# EAGLE design tl494 (EAGLE 9.4.2)
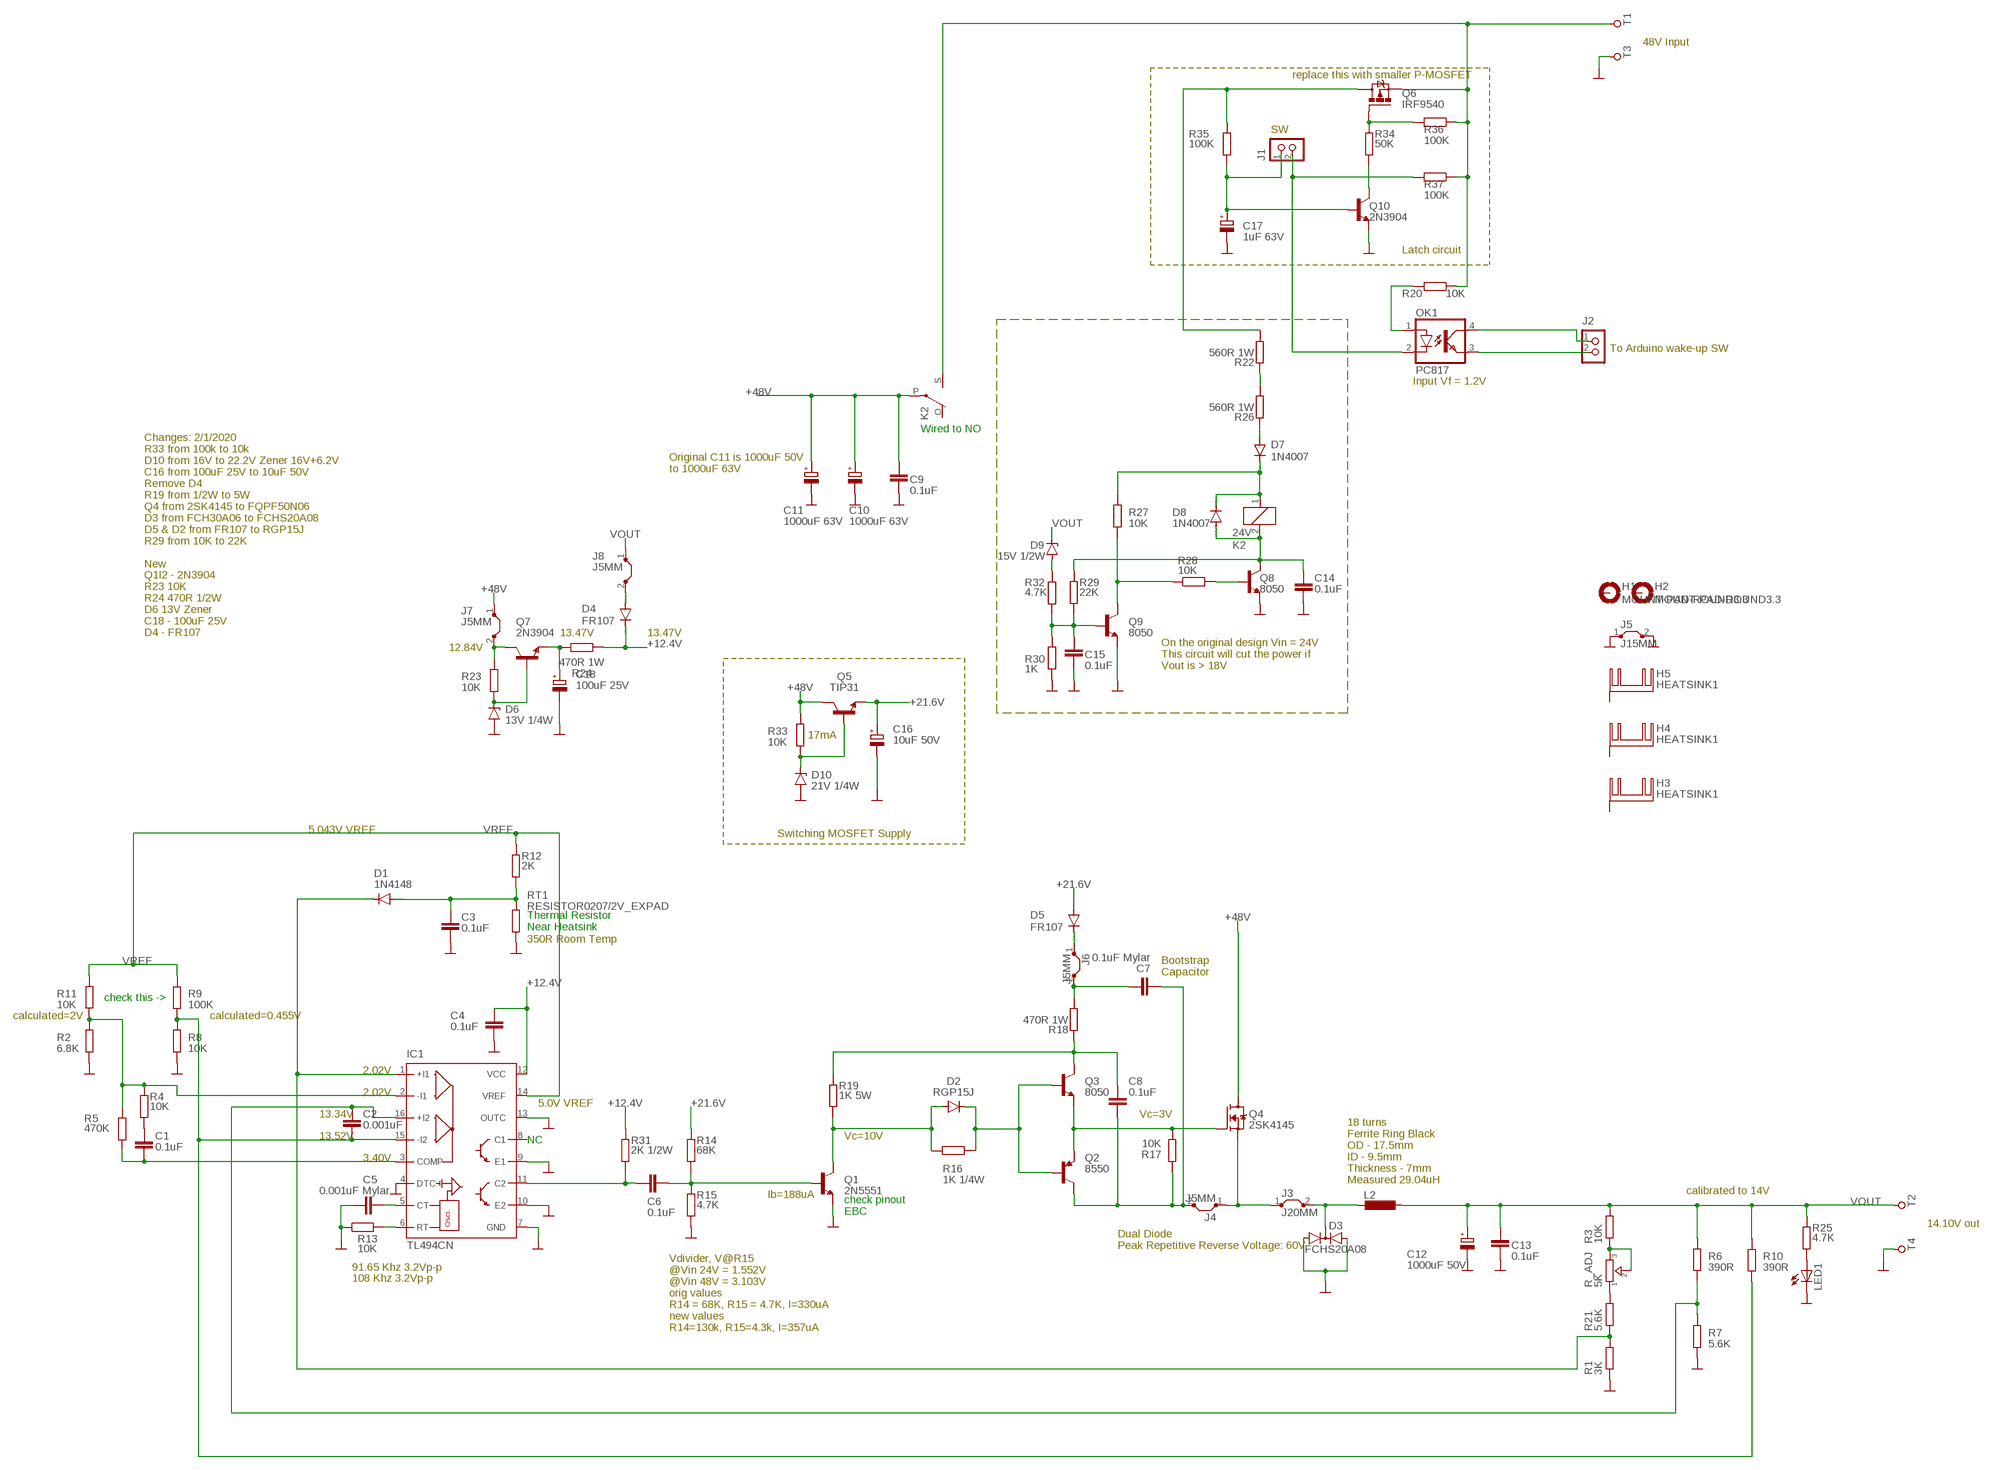
[diagram p0: schematic, sheet 1]

## Parts
C1  0.1uF  CAPACITORC050-024X044_EXPAD  [C050-024X044_EXPAD]
C2  0.001uF  CAPACITORC050-024X044_EXPAD  [C050-024X044_EXPAD]
C3  0.1uF  CAPACITORC050-024X044_EXPAD  [C050-024X044_EXPAD]
C4  0.1uF  CAPACITORC050-024X044_EXPAD  [C050-024X044_EXPAD]
C5  0.001uF Mylar  CAPACITORC050-024X044_EXPAD  [C050-024X044_EXPAD]
C6  0.1uF  CAPACITORC050-024X044_EXPAD  [C050-024X044_EXPAD]
C7  0.1uF Mylar  CAPACITORC050-050X075_EXPAD  [C050-050X075_EXPAD]
C8  0.1uF  CAPACITORC050-024X044_EXPAD  [C050-024X044_EXPAD]
C9  0.1uF  CAPACITORC050-024X044_EXPAD  [C050-024X044_EXPAD]
C10  1000uF 63V  CPOL-EUE7.5-18  [E7,5-18]
C11  1000uF 63V  CPOL-EUE7.5-18  [E7,5-18]
C12  1000uF 50V  CPOL-EUE5-13  [E5-13]
C13  0.1uF  CAPACITORC050-024X044_EXPAD  [C050-024X044_EXPAD]
C14  0.1uF  CAPACITORC050-024X044_EXPAD  [C050-024X044_EXPAD]
C15  0.1uF  CAPACITORC050-024X044_EXPAD  [C050-024X044_EXPAD]
C16  10uF 50V  CAPACITOR-POLE2,5-7_EXPAD  [E2,5-7_EXPAD]
C17  1uF 63V  CAPACITOR-POLE2,5_EXPAD  [E2-5_EXPAD]
C18  100uF 25V  CAPACITOR-POLE2,5-7_EXPAD  [E2,5-7_EXPAD]
D1  1N4148  1N4148DO35-10  [DO35-10]
D2  RGP15J  1N4933  [DO41-10]
D3  FCHS20A08  DIODE-2AC|CATO220V  [TO220ABS]
D4  FR107  1N4933  [DO41-10]
D5  FR107  1N4933  [DO41-10]
D6  13V 1/4W  BZV10  [DO34Z7]
D7  1N4007  1N4933  [DO41-10]
D8  1N4007  1N4933  [DO41-10]
D9  15V 1/2W  BZV10  [DO34Z7]
D10  21V 1/4W  BZV10  [DO34Z7]
H1  MOUNT-PAD-ROUND3.3  [3,3-PAD]
H2  MOUNT-PAD-ROUND3.3  [3,3-PAD]
H3  HEATSINK1  [TO-220_HEATSINK1]
H4  HEATSINK1  [TO-220_HEATSINK1]
H5  HEATSINK1  [TO-220_HEATSINK1]
IC1  TL494CN  [DIL16]
J1  CON_HEADER_1X02-PTH  [M1X2]
J2  CON_HEADER_1X02-PTH  [M1X2]
J3  J20MM  [20]
J4  J5MM  [05]
J5  J15MM  [15]
J6  J5MM  [05]
J7  J5MM  [05]
J8  J5MM  [05]
K2  24V  G5L  [G5LE]
L2  L-EUTJ5-U1  [TJ5-U1]
LED1  LED-5MM  [LED-5MM]
OK1  PC817  [DIL04]
Q1  2N5551  TRANSISTOR_BJT_NPN-TO-92-EBC  [TO-92]
Q2  8550  TRANSISTOR_BJT_PNP-TO-92-EBC  [TO-92]
Q3  8050  TRANSISTOR_BJT_NPN-TO-92-EBC  [TO-92]
Q4  2SK4145  TRANSISTOR_MOSFET-N-TO220V  [TO-220V]
Q5  TIP31  Q_NPN_TIP31  [TO-220V]
Q6  IRF9540  IRF9530  [TO220BV]
Q7  2N3904  TRANSISTOR_BJT_NPN-TO-92-EBC  [TO-92]
Q8  8050  TRANSISTOR_BJT_NPN-TO-92-EBC  [TO-92]
Q9  8050  TRANSISTOR_BJT_NPN-TO-92-EBC  [TO-92]
Q10  2N3904  TRANSISTOR_BJT_NPN-TO-92-EBC  [TO-92]
R1  3K  RESISTOR-0207/10_EXPAD  [0207/10_EXPAD]
R2  6.8K  RESISTOR-0207/10_EXPAD  [0207/10_EXPAD]
R3  10K  RESISTOR-0207/10_EXPAD  [0207/10_EXPAD]
R4  10K  RESISTOR0207/2V_EXPAD  [0207/2V_EXPAD]
R5  470K  RESISTOR0207/2V_EXPAD  [0207/2V_EXPAD]
R6  390R  RESISTOR-0207/10_EXPAD  [0207/10_EXPAD]
R7  5.6K  RESISTOR0207/2V_EXPAD  [0207/2V_EXPAD]
R8  10K  RESISTOR0207/2V_EXPAD  [0207/2V_EXPAD]
R9  100K  RESISTOR-0207/10_EXPAD  [0207/10_EXPAD]
R10  390R  RESISTOR-0207/10_EXPAD  [0207/10_EXPAD]
R11  10K  RESISTOR-0207/10_EXPAD  [0207/10_EXPAD]
R12  2K  RESISTOR-0207/10_EXPAD  [0207/10_EXPAD]
R13  10K  RESISTOR0207/2V_EXPAD  [0207/2V_EXPAD]
R14  68K  RESISTOR0207/2V_EXPAD  [0207/2V_EXPAD]
R15  4.7K  RESISTOR0207/2V_EXPAD  [0207/2V_EXPAD]
R16  1K 1/4W  RESISTOR-0207/10_EXPAD  [0207/10_EXPAD]
R17  10K  RESISTOR0207/2V_EXPAD  [0207/2V_EXPAD]
R18  470R 1W  RESISTOR0414V_EXPAD  [0414V_EXPAD]
R19  1K 5W  RESISTOR0414V_EXPAD  [0414V_EXPAD]
R20  10K  RESISTOR-0207/10_EXPAD  [0207/10_EXPAD]
R21  5.6K  RESISTOR0207/2V_EXPAD  [0207/2V_EXPAD]
R22  560R 1W  RESISTOR0414V_EXPAD  [0414V_EXPAD]
R23  10K  RESISTOR0207/2V_EXPAD  [0207/2V_EXPAD]
R24  470R 1W  RESISTOR0414V_EXPAD  [0414V_EXPAD]
R25  4.7K  RESISTOR-0207/10_EXPAD  [0207/10_EXPAD]
R26  560R 1W  RESISTOR0414V_EXPAD  [0414V_EXPAD]
R27  10K  RESISTOR-0207/10_EXPAD  [0207/10_EXPAD]
R28  10K  RESISTOR-0207/10_EXPAD  [0207/10_EXPAD]
R29  22K  RESISTOR-0207/10_EXPAD  [0207/10_EXPAD]
R30  1K  RESISTOR0207/2V_EXPAD  [0207/2V_EXPAD]
R31  2K 1/2W  RESISTOR0207/2V_EXPAD  [0207/2V_EXPAD]
R32  4.7K  RESISTOR0207/2V_EXPAD  [0207/2V_EXPAD]
R33  10K  RESISTOR0207/2V_EXPAD  [0207/2V_EXPAD]
R34  50K  RESISTOR0207/2V_EXPAD  [0207/2V_EXPAD]
R35  100K  RESISTOR0207/2V_EXPAD  [0207/2V_EXPAD]
R36  100K  R-EU_0207/2V  [0207/2V]
R37  100K  R-EU_0207/10  [0207/10]
R_ADJ  5K  TRIMMER-3362P_EXPAD  [TRIMMER_3362P_EXPAD]
RT1  RESISTOR0207/2V_EXPAD  [0207/2V_EXPAD]
T1  PAD_TERMINAL-1.02MM_ROUND  [CON_PAD_ROUND_1.02MM]
T2  PAD_TERMINAL-1.02MM_ROUND  [CON_PAD_ROUND_1.02MM]
T3  PAD_TERMINAL-1.02MM_SQUARE  [CON_PAD_SQUARE_1.02MM]
T4  PAD_TERMINAL-1.02MM_ROUND  [CON_PAD_ROUND_1.02MM]

## Nets
+12.4V: C4.2 D4.C IC1.12(VCC) R24.1 R31.2
+21.6V: C16.+ D5.A Q5.3(E) R14.2
+48V: C9.1 C10.+ C11.+ J7.1 K2.P(2:P) Q4.2(D) Q5.2(C) R33.1
GND: C3.1 C4.1 C5.2 C9.2 C10.- C11.- C12.- C13.2 C14.2 C15.2 C16.- C17.- C18.- D3.A1 D3.A2 D6.A D10.A IC1.4(DTC) IC1.7(GND) IC1.9(E1) IC1.10(E2) IC1.13(OUTC) J5.1 J5.2 LED1.K(C) Q1.1(E) Q8.1(E) Q9.1(E) Q10.1(E) R1.1 R2.1 R7.1 R8.1 R13.1 R15.1 R30.1 RT1.2 T3.P T4.P ; supply symbol labelled SUPPLY_GND
N$1: C2.2 IC1.16(+I2) R6.1 R7.2
N$2: R3.1 R_ADJ.2 R_ADJ.3
N$3: R21.2 R_ADJ.1
N$4: IC1.2(-I1) R2.2 R4.2 R5.1 R11.1
N$5: C1.2 R4.1
N$6: C1.1 IC1.3(COMP) R5.2
N$7: D1.C IC1.1(+I1) R1.2 R21.1
N$8: C2.1 IC1.15(-I2) R8.2 R9.2 R10.2
N$9: C3.2 D1.A R12.1 RT1.1
N$10: C6.2 IC1.11(C2) R31.1
N$11: C5.1 IC1.5(CT)
N$12: IC1.6(RT) R13.2
N$13: C6.1 Q1.2(B) R14.1 R15.2
N$14: D2.A Q1.3(C) R16.1 R19.1
N$15: D2.C Q2.2(B) Q3.2(B) R16.2
N$16: Q2.1(E) Q3.1(E) Q4.1(G) R17.2
N$17: C7.2 C8.2 J4.2 Q2.3(C) R17.1
N$18: C8.1 Q3.3(C) R18.2 R19.2
N$19: C7.1 J6.2 R18.1
N$20: OK1.1(A) R20.2
N$21: LED1.A R25.1
N$22: D7.A R26.2
N$23: D7.C D8.C K2.1 R27.2
N$24: C14.1 D8.A K2.2 Q8.3(C) R29.2
N$25: Q9.3(C) R27.1 R28.1
N$26: Q8.2(B) R28.2
N$27: C15.1 Q9.2(B) R29.1 R30.2 R32.2
N$28: D9.A R32.1
N$29: J2.1 OK1.4(COL)
N$30: Q6.G R34.2 R36.2
N$31: Q10.3(C) R34.1
N$32: Q6.D R22.1 R35.2
N$33: C17.+ J1.1 Q10.2(B) R35.1
N$34: J1.2 OK1.2(C) R37.2
N$35: J2.2 OK1.3(EMIT)
N$36: R22.2 R26.1
N$37: D3.C J3.2 L2.2
N$38: J3.1 J4.1 Q4.3(S)
N$39: D10.C Q5.1(B) R33.2
N$40: D6.C Q7.2(B) R23.2
N$41: C18.+ Q7.1(E) R24.2
N$42: D5.C J6.1
N$43: J7.2 Q7.3(C) R23.1
N$44: D4.A J8.2
VIN: K2.S(2:S) Q6.S R20.1 R36.1 R37.1 T1.P
VOUT: C12.+ C13.1 D9.C J8.1 L2.1 R3.2 R6.2 R10.1 R25.2 T2.P
VREF: IC1.14(VREF) R9.1 R11.2 R12.2
Unconnected: H1.B3,3(MOUNT) H2.B3,3(MOUNT) H3.1(K) H4.1(K) H5.1(K) IC1.8(C1) K2.O(2:O)

## Notes on the sheet
- 48V Input
- replace this with smaller P-MOSFET
- SW
- Latch circuit
- To Arduino wake-up SW
- Input Vf = 1.2V
- Wired to NO
- Original C11 is 1000uF 50V
  to 1000uF 63V
- Changes: 2/1/2020
  R33 from 100k to 10k
  D10 from 16V to 22.2V Zener 16V+6.2V
  C16 from 100uF 25V to 10uF 50V
  Remove D4
  R19 from 1/2W to 5W
  Q4 from 2SK4145 to FQPF50N06
  D3 from FCH30A06 to FCHS20A08
  D5 & D2 from FR107 to RGP15J
  R29 from 10K to 22K
  
  New
  Q1I2 - 2N3904
  R23 10K
  R24 470R 1/2W
  D6 13V Zener
  C18 - 100uF 25V
  D4 - FR107
- 13.47V | 13.47V
- 12.84V
- On the original design Vin = 24V
  This circuit will cut the power if
  Vout is > 18V
- 17mA
- 5.043V VREF | Switching MOSFET Supply
- Thermal Resistor
  Near Heatsink
- 350R Room Temp
- Bootstrap
  Capacitor
- check this ->
- calculated=2V | calculated=0.455V
- 2.02V
- 2.02V
- 5.0V VREF
- 13.34V | Vc=3V
- 13.52V | NC | Vc=10V
- 3.40V
- 18 turns
  Ferrite Ring Black
  OD - 17.5mm
  ID - 9.5mm
  Thickness - 7mm
  Measured 29.04uH
- Ib=188uA | calibrated to 14V
- check pinout
  EBC
- 14.10V out
- Dual Diode
  Peak Repetitive Reverse Voltage: 60V
- 91.65 Khz 3.2Vp-p
- 108 Khz 3.2Vp-p
- Vdivider, V@R15
  @Vin 24V = 1.552V
  @Vin 48V = 3.103V
  orig values
  R14 = 68K, R15 = 4.7K, I=330uA
  new values
  R14=130k, R15=4.3k, I=357uA

## Library data of the parts
C1-C9 C13-C15 = trosh_devices.eagle.v9:CAPACITOR
C10-C12 = rcl:CPOL-EU: POLARIZED CAPACITOR, European symbol; SPICEPREFIX: C
C16-C18 = trosh_devices.eagle.v9:CAPACITOR-POL
D1 = diode:1N4148: DIODE high speed (Philips)
D2 D4 D5 D7 D8 = diode:1N4933: DIODE fast recovery rectifier, 1A
D3 = diode:DIODE-2AC|CA: Dual DIODE Anode-Cathode|Cathode-Anode
D6 D9 D10 = diode:BZV10: Z DIODE
H1 H2 = holes:MOUNT-PAD-ROUND: MOUNTING PAD, round
H3-H5 = trosh_devices.eagle.v9:HEATSINK1
IC1 = linear:TL494*: SWITCHMODE Pulse Width Modulation Control Circuit NCV494B http://onsemi.com tl494-d.pdf
J1 J2 = dp_devices.v6:CON_HEADER_1X02
J3-J8 = jumper:J: Bridge
K2 = relay:G5L: RELAY 1 x switch, 10 A/120 V AC, 8 A/30 V ADC, Omron; OC_FARNELL: unknown; OC_NEWARK: unknown
L2 = rcl:L-EU: INDUCTOR, European symbol; SPICEPREFIX: L
LED1 = dp_devices.v6:LED: Light Emitting Diode
OK1 = optocoupler:PC817: SHARP OPTO COUPLER; MPN: PC817X4J000F; OC_FARNELL: 9707727; OC_NEWARK: 97K7059
Q1 Q3 Q7-Q10 = dp_devices.v6:TRANSISTOR_BJT_NPN: Most commonly used is SOT23-BEC
Q2 = dp_devices.v6:TRANSISTOR_BJT_PNP: Most commonly used is SOT23-BEC
Q4 = dp_devices.v6:TRANSISTOR_MOSFET-N
Q5 = trosh_devices.eagle.v9:Q_NPN_TIP31
Q6 = transistor-power:IRF9530: P-CHANNEL HEXFET POWER-MOS-FET Source: http://www.irf.com/product-info/datasheets/data/irf9530.pdf
R1-R35 RT1 = trosh_devices.eagle.v9:RESISTOR
R36 R37 = rcl:R-EU_: RESISTOR, European symbol; SPICEPREFIX: R
R_ADJ = trosh_devices.eagle.v9:TRIMMER: Trimmer resistor
T1-T4 = dp_devices.v6:PAD_TERMINAL: Terminal connection pad

## Board
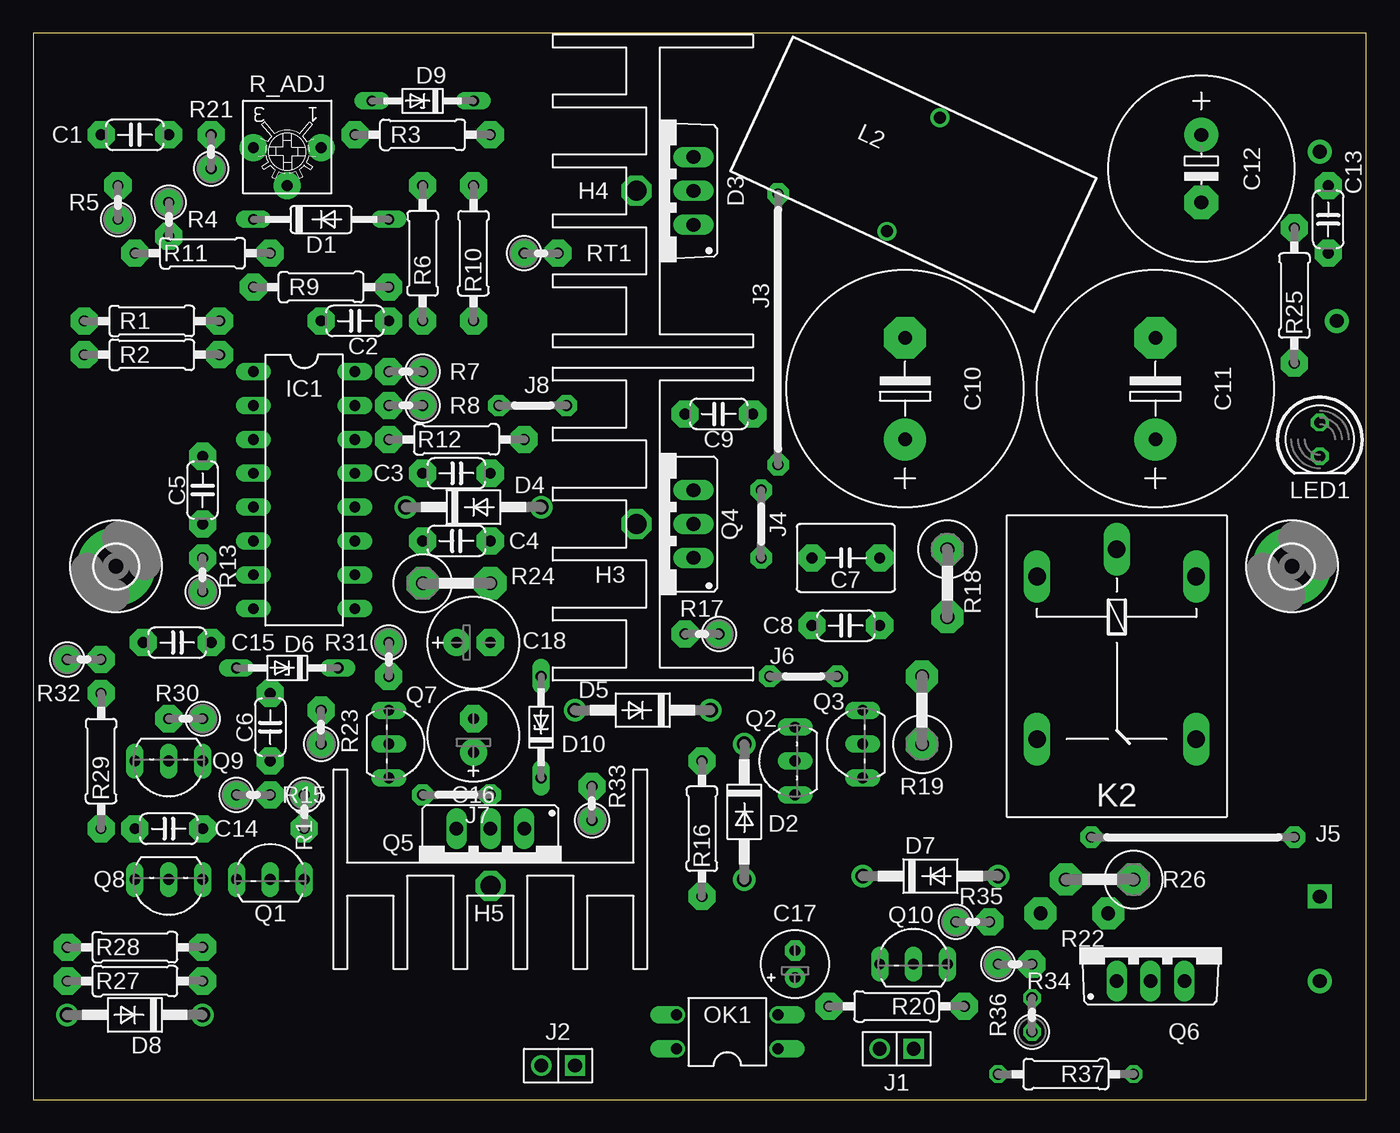
[diagram p1: board, top side]
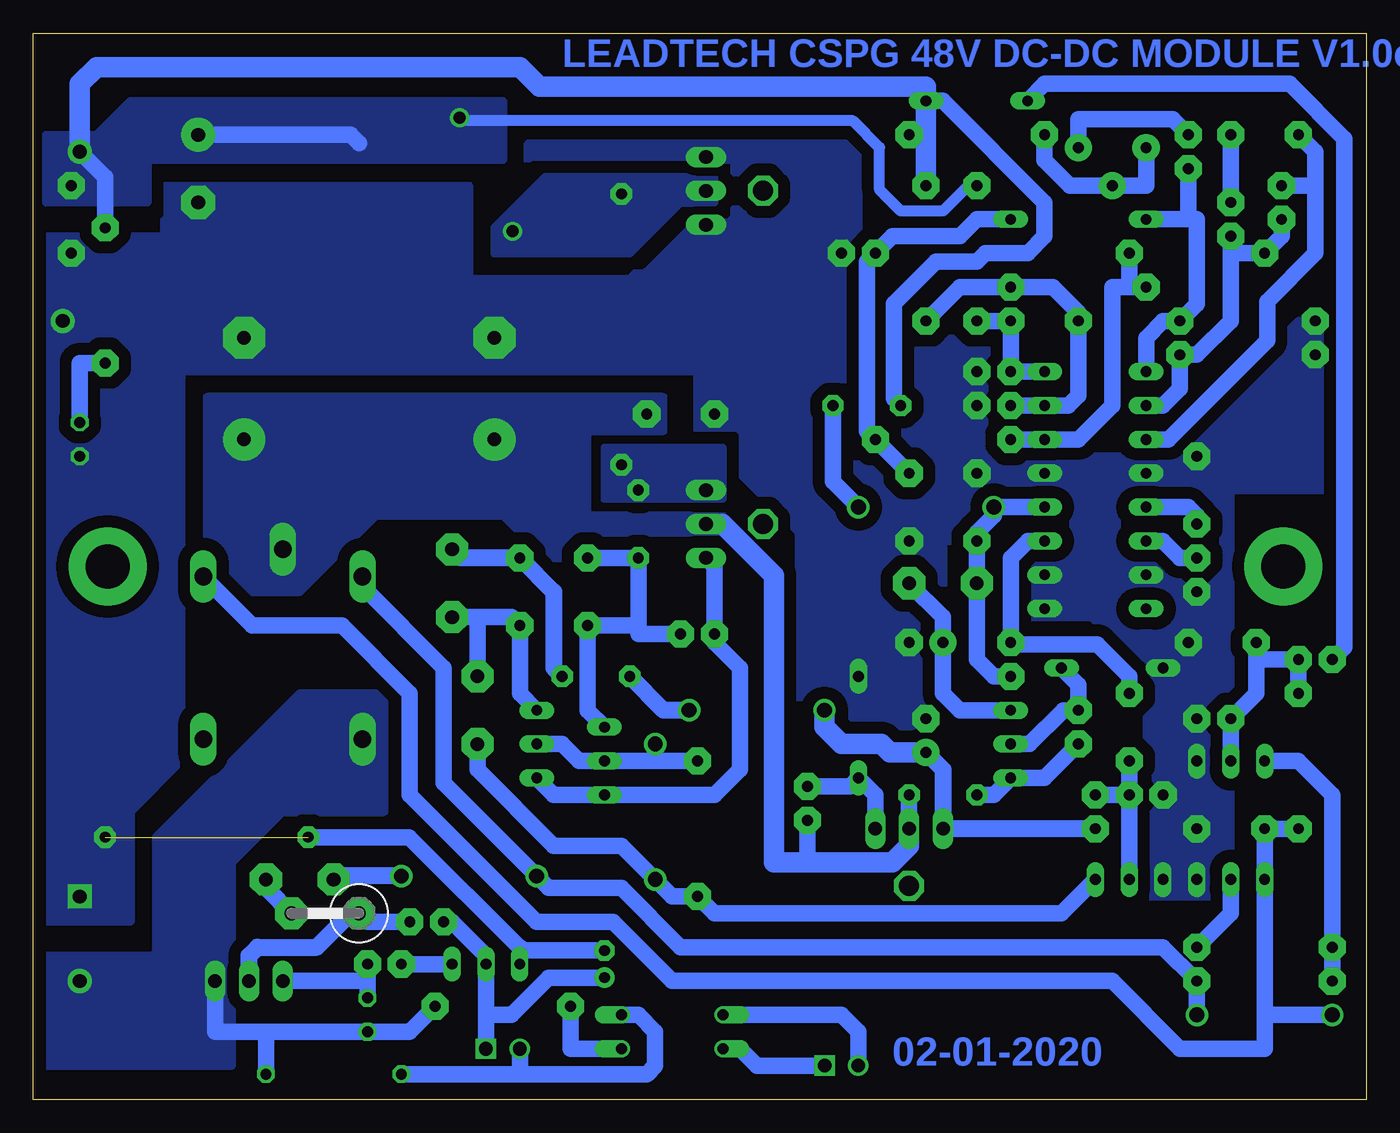
[diagram p2: board, bottom side, seen from below]

Size 100 x 80 mm. Coordinates in mm from the lower left corner, seen from the top.
Outline: 0,0 100,0 100,80 0,80 0,0
Copper layers (1*16): Top 0.035mm / dielectric 1.5mm / Bottom 0.035mm
Design rules "dirt_cheap_dirty_boards.v1.1": minimum track width 6mil, minimum drill 12mil, track to track 6mil, track to pad 6mil, pad to pad 6mil, via to via 6mil, smd to smd 0mil, copper to edge 10mil, drill to drill 10mil, minimum pad ring 10mil, minimum via ring 6mil, stop-mask expansion 2mil, vias tented up to drill 25mil, thermal gap 10mil

### Footprints (pad centres in the part's own frame; a part is rotated, then mirrored left to right if it is on the bottom)
C050-024X044_EXPAD = drill 0.813 pad 2.032 octagon: 1 -2.54,0; 2 2.54,0
C050-050X075_EXPAD = drill 0.813 pad 2.032 octagon: 1 -2.54,0; 2 2.54,0
E7,5-18 = drill 1.016 pad 3.15: + -3.81,0 | drill 1.016 pad 3.15 octagon: - 3.81,0
E5-13 = drill 1.016 pad 2.54: + -2.54,0 | drill 1.016 pad 2.54 octagon: - 2.54,0
E2,5-7_EXPAD = drill 0.813 pad 2.032: + -1.27,0 | drill 0.813 pad 2.032 octagon: - 1.27,0
E2-5_EXPAD = drill 0.813 pad 1.524: + -1.016,0 | drill 0.813 pad 1.524 octagon: - 1.016,0
DO35-10 = drill 0.813 long: A 5.08,0; C -5.08,0
DO41-10 = drill 1.118: A 5.08,0; C -5.08,0
TO220ABS = drill 1.016 long: A1 -2.54,-2.54; A2 2.54,-2.54; C 0,-2.54
DO34Z7 = drill 0.813 long: A 3.81,0; C -3.81,0
3,3-PAD = drill 3.3 pad 5.842: B3,3 0,0
TO-220_HEATSINK1 = drill 1.5 octagon: 1 0,1.75
DIL16 = drill 0.813 long: 1 -8.89,-3.81; 2 -6.35,-3.81; 3 -3.81,-3.81; 4 -1.27,-3.81; 5 1.27,-3.81; 6 3.81,-3.81; 7 6.35,-3.81; 8 8.89,-3.81; 9 8.89,3.81; 10 6.35,3.81; 11 3.81,3.81; 12 1.27,3.81; 13 -1.27,3.81; 14 -3.81,3.81; 15 -6.35,3.81; 16 -8.89,3.81
M1X2 = drill 1.02 square: 1 -1.27,0 | drill 1.02: 2 1.27,0
20 = drill 0.813 pad 1.6 octagon: 1 -10.16,0; 2 10.16,0
05 = drill 0.813 pad 1.6 octagon: 1 -2.54,0; 2 2.54,0
15 = drill 0.813 pad 1.6 octagon: 1 -7.62,0; 2 7.62,0
G5LE = drill 1.321 long: 1 -7.493,-5.969; 2 -7.493,5.969; O 4.699,5.969; P -9.525,0; S 4.699,-5.969
TJ5-U1 = drill 0.9: 1 -4.7,0; 2 4.7,0
LED-5MM = drill 0.813 octagon: A -1.27,0; K 1.27,0
DIL04 = drill 0.813 offset: 1 -1.27,-3.81; 2 1.27,-3.81; 3 1.27,3.81; 4 -1.27,3.81
TO-92 = drill 0.813 long: 1 -2.54,0; 2 0,0; 3 2.54,0
TO-220V = drill 1.016 long: 1 -2.54,0; 2 0,0; 3 2.54,0
TO220BV = drill 1.016 long: D 0,-2.54; G -2.54,-2.54; S 2.54,-2.54
0207/10_EXPAD = drill 0.813 pad 2.032 octagon: 1 -5.08,0; 2 5.08,0
0207/2V_EXPAD = drill 0.813 pad 2.032 octagon: 1 -1.27,0; 2 1.27,0
0414V_EXPAD = drill 1.016 pad 2.413 octagon: 1 -2.54,0; 2 2.54,0
0207/2V = drill 0.813 octagon: 1 -1.27,0; 2 1.27,0
0207/10 = drill 0.813 octagon: 1 -5.08,0; 2 5.08,0
TRIMMER_3362P_EXPAD = drill 0.813 pad 2.032: 1 -2.54,-0.31; 2 0,2.54; 3 2.54,-0.31
CON_PAD_ROUND_1.02MM = drill 1.02 pad 1.81: P 0,0
CON_PAD_SQUARE_1.02MM = drill 1.02 pad 1.81 square: P 0,0

### Placement (x,y rotation side)
C1  7.62,72.39 0 top
C2  24.13,58.42 0 top
C3  31.75,46.99 0 top
C4  31.75,41.91 180 top
C5  12.7,45.72 90 top
C6  17.78,27.94 90 top
C7  60.96,40.64 180 top
C8  60.96,35.56 180 top
C9  51.44,51.44 180 top
C10  65.41,53.34 90 top
C11  84.19,53.34 90 top
C12  87.63,69.85 270 top
C13  97.16,66.04 270 top
C14  10.16,20.32 0 top
C15  10.79,34.29 0 top
C16  33.02,27.3 90 top
C17  57.15,10.16 90 top
C18  33.02,34.29 0 top
D1  21.59,66.04 0 top
D2  53.34,21.59 270 top
D3  46.99,68.18 90 top
D4  33.02,44.45 0 top
D5  45.72,29.21 180 top
D6  19.05,32.38 180 top
D7  67.31,16.76 0 top
D8  7.62,6.35 180 top
D9  29.21,74.93 180 top
D10  38.1,27.94 90 top
H1  94.43,40 0 top
H2  6.21,40 0 top
H3  46.99,43.18 90 top
H4  46.99,68.18 90 top
H5  34.29,17.78 180 top
IC1  20.32,45.72 270 top
J1  64.77,3.81 180 top
J2  39.37,2.54 180 top
J3  55.88,57.78 90 top
J4  54.61,43.18 270 top
J5  87,19.68 0 top
J6  57.78,31.75 0 top
J7  31.75,22.86 180 top
J8  37.47,52.07 0 top
K2  81.28,31.75 270 top
L2  66.04,69.4 245 top
LED1  96.52,49.53 270 top
OK1  52.07,5.08 90 top
Q1  17.78,16.51 0 top
Q2  57.15,25.4 90 top
Q3  62.23,26.67 90 top
Q4  49.53,43.18 90 top
Q5  34.29,20.32 180 top
Q6  83.82,11.43 0 top
Q7  26.67,26.67 270 top
Q8  10.16,16.51 180 top
Q9  10.16,25.4 180 top
Q10  66.04,10.16 0 top
R1  8.89,58.42 0 top
R2  8.89,55.88 0 top
R3  29.21,72.39 0 top
R4  10.16,66.04 270 top
R5  6.35,67.31 90 top
R6  29.21,63.5 90 top
R7  27.94,54.61 180 top
R8  27.94,52.07 180 top
R9  21.59,60.96 0 top
R10  33.02,63.5 270 top
R11  12.7,63.5 0 top
R12  31.75,49.53 180 top
R13  12.7,39.37 90 top
R14  20.32,21.59 270 top
R15  16.51,22.86 0 top
R16  50.16,20.32 90 top
R17  50.16,34.92 180 top
R18  68.58,38.73 270 top
R19  66.67,29.21 90 top
R20  64.77,6.99 180 top
R21  13.34,71.12 90 top
R22  78.11,13.97 180 bottom
R23  21.59,27.94 90 top
R24  31.75,38.73 0 top
R25  94.61,60.33 90 top
R26  80.01,16.51 180 top
R27  7.62,8.89 0 top
R28  7.62,11.43 0 top
R29  5.08,25.4 270 top
R30  11.43,28.57 180 top
R31  26.67,33.02 270 top
R32  3.81,33.02 0 top
R33  41.91,22.23 90 top
R34  73.66,10.16 0 top
R35  70.48,13.34 0 top
R36  74.93,6.35 90 top
R37  77.47,1.91 180 top
R_ADJ  19.05,71.12 180 top
RT1  38.1,63.5 0 top
T1  96.52,8.89 0 top
T2  96.52,71.12 0 top
T3  96.52,15.24 0 top
T4  97.79,58.42 0 top

### Tracks (layer width: path | path; a pad name or v marks a point on that pad's centre or on a via)
+12.4V
  Bottom 1.219: R31.2 27.94,31.75 29.21,33.02 R24.1 C4.2 29.21,42.55 27.94,43.81 D4.C IC1.12
+21.6V
  Bottom 1.27: R14.2 Q5.3 31.75,24.77 C16.+
  Bottom 1.524: C16.+ 35.75,26.04 36.38,26.67 39.37,26.67 40.64,27.94 D5.A
+48V
  Bottom 1.219: R33.1 41.91,17.78 | Q5.2 J7.1
  Bottom 1.524: Q5.2 34.29,19.05 35.56,17.78 41.91,17.78 44.45,17.78 44.45,39.33 48.3,43.18 Q4.2
  pour Bottom (isolate 0.914, no thermals): 87,52.7 87,38.1 80.01,38.1 74.3,43.81 64.77,43.81 61.59,40.64 57.15,40.64 57.15,42.55 48.26,42.55 48.26,43.81 58.42,43.81 58.42,50.16 52.7,50.16 52.7,52.7
GND  (1 unrouted)
  Bottom 1.219: J5.1 71.79,19.68 63.28,11.18 | 63.5,11.43 Q10.1 63.5,11.18 63.28,11.18 | 63.28,11.18 C17.-
  pour Bottom (isolate 0.914, rank 6, no thermals): 99.06,13.34 99.06,64.77 90.17,64.77 90.17,68.58 67.31,68.58 67.31,61.59 55.24,61.59 50.16,66.67 50.16,69.85 62.87,69.85 62.87,71.75 38.1,71.75 38.1,48.26 36.83,46.99 31.75,46.99 31.75,29.21 33.02,27.94 42.55,27.94 42.55,42.55 50.16,50.16 50.16,54.61 88.9,54.61 88.9,25.4 92.71,21.59 92.71,13.34
  pour Bottom (isolate 0.914, rank 6, no thermals): 27.94,60.96 35.56,60.96 35.56,41.91 25.4,41.91 25.4,36.2 20.64,36.2 16.51,32.07 16.51,15.24 10.16,15.24 10.16,45.72 2.54,45.72 2.54,58.42 5.08,58.42 15.24,48.26 27.94,48.26
N$1
  Bottom 1.219: IC1.16 R7.2 C2.2 R6.1
N$2
  Bottom 1.219: R_ADJ.3 16.51,68.58 R_ADJ.2 22.23,68.58 24.13,70.48 R3.1
N$3
  Bottom 1.219: R21.2 14.5,73.56 21.59,73.56 R_ADJ.1
N$4
  Bottom 1.219: R5.1 6.35,64.77 R11.1 10.16,63.5 | IC1.2 15.24,52.07 13.97,53.34 R2.2 12.7,55.88 10.16,58.42 10.16,63.5 | R4.2 10.16,63.5
N$5
  Bottom 1.219: R4.1 C1.2
N$6
  Bottom 1.219: IC1.3 14.86,49.53 7.43,56.96 7.43,59.88 3.81,63.5 3.81,68.58 | C1.1 3.81,71.12 3.81,68.58 | R5.2 3.81,68.58
N$7
  Bottom 1.219: R21.1 13.34,66.04 | IC1.1 16.51,57.15 15.24,58.42 R1.2 12.7,59.69 12.7,66.04 13.34,66.04 | D1.C 13.34,66.04
N$8
  Bottom 1.219: R8.2 IC1.15 22.35,52.07 21.59,52.83 C2.1 21.59,59.05 23.5,60.96 R9.2 30.48,60.96 R10.2
N$9
  Bottom 1.219: C3.2 R12.1 37.47,50.16 37.47,62.87 RT1.1 35.56,64.77 30.48,64.77 29.21,66.04 D1.A
N$10
  Bottom 1.219: IC1.11 25.4,41.91 26.67,40.64 R31.1 26.67,34.14 20.17,34.14 17.78,31.75 C6.2
N$11
  Bottom 1.219: IC1.5 13.34,44.45 12.7,43.81 C5.1
N$12
  Bottom 1.219: IC1.6 15.24,41.91 13.97,40.64 R13.2
N$13
  Bottom 1.219: R14.1 R15.2 | Q1.2 R15.2 | R15.2 C6.1
N$14
  Bottom 1.219: Q1.3 22.86,13.97 48.9,13.97 R16.1 52.07,15.24 D2.A 55.88,19.05 60.96,19.05 66.67,24.77 R19.1
N$15
  Bottom 1.219: Q3.2 60.33,26.67 59.05,25.4 Q2.2 53.34,25.4 | R16.2 53.34,25.4 | D2.C 53.34,25.4
N$16
  Bottom 1.219: Q3.1 60.96,22.86 Q2.1 48.9,22.86 46.99,24.77 46.99,32.38 48.9,34.29 R17.2 48.9,40.01 Q4.1
N$17
  Bottom 1.219: C7.2 J4.2 54.61,35.56 | R17.1 54.61,34.92 54.61,35.56 | 54.61,35.56 C8.2 58.42,29.21 Q2.3
N$18
  Bottom 1.219: Q3.3 63.5,30.48 C8.1 64.14,36.2 66.67,36.2 | R19.2 66.67,36.2 | 66.67,36.2 R18.2
N$19
  Bottom 1.27: R18.1 67.94,40.64 C7.1 60.96,38.1 60.96,32.38 J6.2
N$20
  Bottom 1.219: OK1.1 59.69,3.81 R20.2
N$21
  Bottom 1.219: R25.1 96.52,55.24 LED1.A
N$22
  Bottom 1.27: D7.A 77.22,16.76 R26.2
N$23
  Bottom 1.219: K2.1 75.31,38.48 69.22,32.38 69.22,23.75 D7.C 61.34,15.88 55.88,15.88 51.44,11.43 15.24,11.43 R27.2 D8.C
N$24
  Bottom 1.219: R29.2 C14.1 Q8.3 7.62,6.35 | 7.62,6.35 7.62,3.81 13.97,3.81 19.05,8.89 52.07,8.89 56.52,13.34 62.23,13.34 71.75,22.86 71.75,30.48 76.83,35.56 83.57,35.56 K2.2 | D8.A 7.62,6.35
N$25
  Bottom 1.219: Q9.3 5.08,25.4 2.54,22.86 R28.1 R27.1
N$26
  Bottom 1.219: R28.2 10.16,13.97 Q8.2
N$27
  Bottom 1.219: R29.1 R32.2 8.26,33.02 | C15.1 8.26,33.02 | 8.26,33.02 8.26,30.48 R30.2 Q9.2
N$28
  Bottom 1.219: D9.A 24.13,76.2 5.71,76.2 1.63,72.11 1.63,33.93 R32.1
N$29
  Bottom 1.219: J2.1 45.72,2.54 46.99,3.81 OK1.4
N$30
  Bottom 1.219: R36.2 74.93,8.89 | 74.93,8.89 R34.2 | Q6.G 74.93,8.89
N$31
  Bottom 1.219: Q10.3 R34.1
N$32
  Bottom 1.219: R35.2 74.93,13.34 R22.1
  Bottom 1.27: Q6.D 83.82,10.79 83.19,11.43 78.74,11.43 76.2,13.97 R22.1
N$33
  Bottom 1.219: J1.1 66.04,6.35 | 66.04,6.35 Q10.2 66.04,10.79 68.58,13.34 R35.1 | C17.+ 61.34,9.14 64.14,6.35 66.04,6.35
N$34
  Bottom 1.219: J1.2 63.5,1.91 | R37.2 63.5,1.91 | OK1.2 54.61,6.35 53.34,5.08 53.34,2.54 53.98,1.91 63.5,1.91
N$35
  Bottom 1.219: J2.2 38.1,5.08 39.37,6.35 OK1.3
N$36
  Bottom 1.27: R26.1 82.55,15.88 R22.2
N$37
  pour Bottom (isolate 0.61, no thermals): 48.9,69.22 61.59,69.22 65.41,65.41 65.41,63.5 55.24,63.5 51.44,67.31 48.9,67.31
N$38
  pour Bottom (isolate 0.61, no thermals): 48.26,48.9 57.15,48.9 57.15,45.09 48.26,45.09
N$39
  Bottom 1.219: R33.2 38.73,23.5 D10.C 36.83,22.86 Q5.1
N$40
  Bottom 1.219: D6.C 21.59,31.11 R23.2 22.73,29.21 25.27,26.67 Q7.2
N$41
  Bottom 1.219: Q7.1 30.48,29.21 31.75,30.48 C18.+ 31.75,36.2 R24.2
N$42
  Bottom 1.27: D5.C 52.7,29.21 J6.1
N$43
  Bottom 1.219: J7.2 27.94,22.86 Q7.3 24.13,24.13 R23.1
N$44
  Bottom 1.219: J8.2 40.01,46.35 D4.A
VIN
  Bottom 1.219: 82.55,5.08 R36.1 71.75,5.08 R20.1 | Q6.S 86.36,5.08 82.55,5.08 | R37.1 82.55,5.08
  pour Bottom (isolate 0.914, no thermals): 99.06,10.79 99.06,2.54 85.09,2.54 85.09,17.78 81.28,21.59 73.66,21.59 73.66,30.48 80.01,30.48 90.81,19.68 90.81,10.79
VOUT
  Bottom 0.813: L2.1 67.88,73.47 38.55,73.47 36.51,71.44 36.51,68.26 34.92,66.67 31.75,66.67 29.84,68.58 R6.2
  Bottom 1.219: C12.+ 76.2,72.39 75.56,71.75 | R25.2 94.61,69.22 T2.P | J8.1 35.43,52.58 35.43,59.72 32.28,62.87 29.21,62.87 28.57,63.5 25.4,63.5 24.13,64.77 24.13,67.31 31.75,74.93 D9.C
  Bottom 1.524: T2.P 96.52,76.2 95.25,77.47 63.5,77.47 62.01,75.98 33.02,75.98 D9.C 33.02,72.39 | 33.02,72.39 R10.1 | R3.2 33.02,72.39
  pour Bottom (isolate 0.61, no thermals): 64.77,70.48 91.44,70.48 91.44,67.31 99.06,67.31 99.06,72.39 95.25,72.39 92.71,74.93 64.77,74.93
VREF
  Bottom 1.219: R12.2 IC1.14 21.59,49.53 19.05,52.07 19.05,60.96 17.78,60.96 | R9.1 17.78,60.96 | R11.2 17.78,60.96

### Text on the board
Bottom: LEADTECH CSPG 48V DC-DC MODULE V1.0c | 02-01-2020